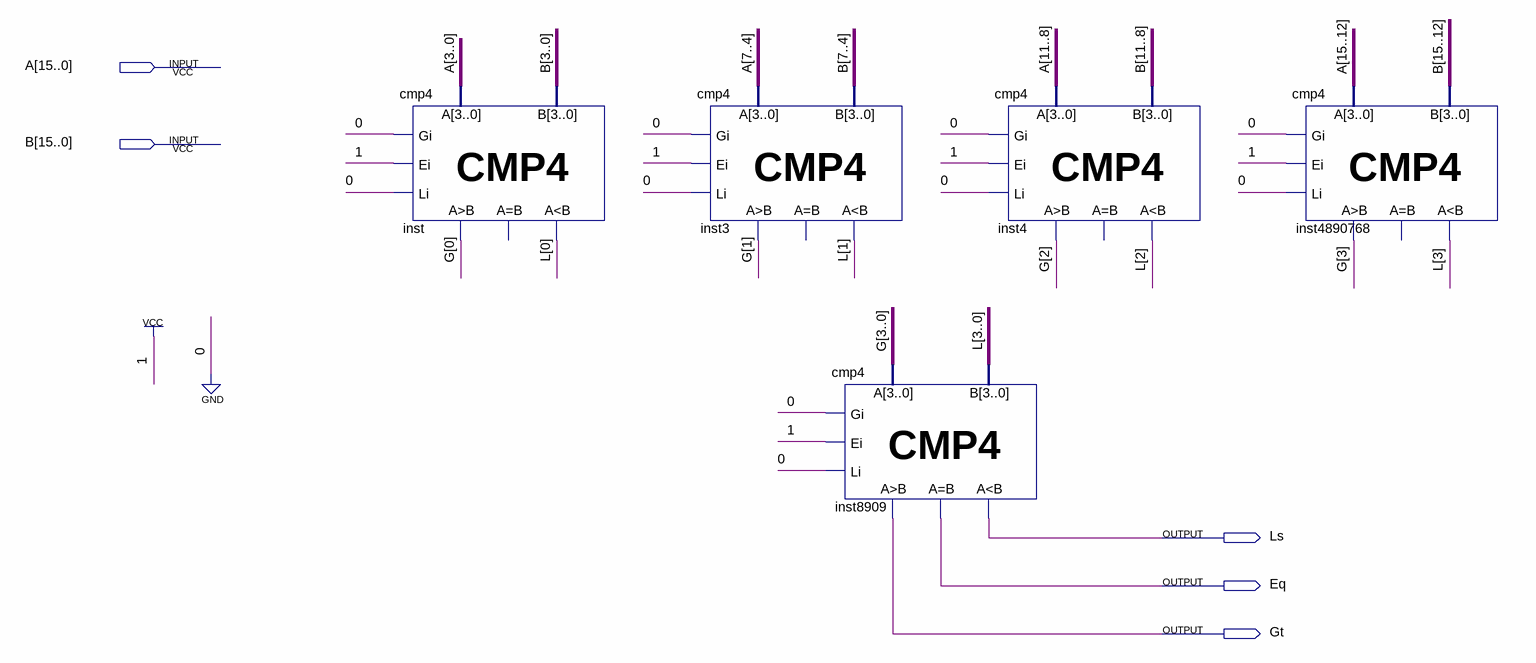
[diagram p0: schematic sheet]
// Quartus schematic cmp16.bdf as structural Verilog: 5 symbols, 5 pins
module cmp16 (
  input  [15:0] A,
  input  [15:0] B,
  output Ls,
  output Eq,
  output Gt
);

  wire [3:0] G, L;

  cmp4 inst (.A(A[3:0]), .B(B[3:0]), .Gi(1'b0), .Ei(1'b1), .Li(1'b0), .Gi_1(G[0]), .Li_1(L[0]));  // open: Ei_1
  cmp4 inst3 (.A(A[7:4]), .B(B[7:4]), .Gi(1'b0), .Ei(1'b1), .Li(1'b0), .Gi_1(G[1]), .Li_1(L[1]));  // open: Ei_1
  cmp4 inst8909 (.A(G), .B(L), .Gi(1'b0), .Ei(1'b1), .Li(1'b0), .Gi_1(Gt), .Ei_1(Eq), .Li_1(Ls));
  cmp4 inst4 (.A(A[11:8]), .B(B[11:8]), .Gi(1'b0), .Ei(1'b1), .Li(1'b0), .Gi_1(G[2]), .Li_1(L[2]));  // open: Ei_1
  cmp4 inst4890768 (
    .A(A[15:12]), .B(B[15:12]), .Gi(1'b0), .Ei(1'b1), .Li(1'b0), .Gi_1(G[3]), .Li_1(L[3]));  // open: Ei_1
endmodule
